# Altium schematic sheet Voltage input.SchDoc
size 431 x 279 mm; SheetNumber: 1; SheetTotal: 5
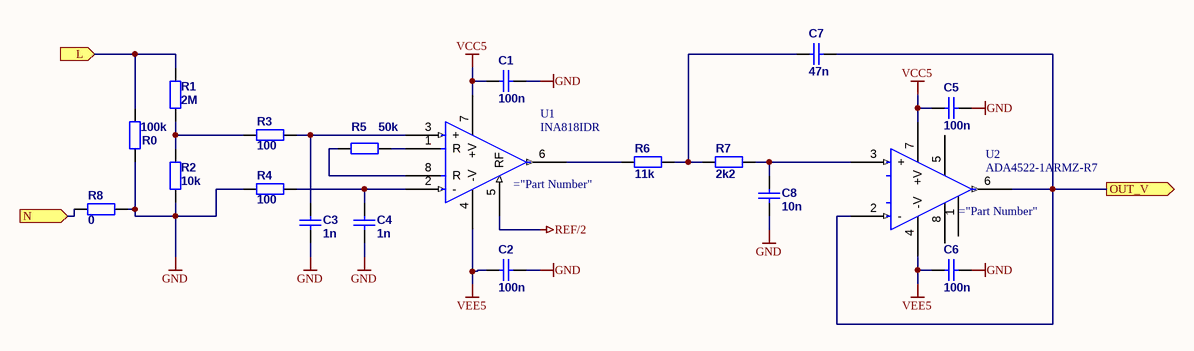
[diagram p0: Voltage input.SchDoc]

## Parts
C1  100n  [C0805]
C2  100n  [C0805]
C3  1n  [C1206]
C4  1n  [C1206]
C5  100n  [C0805]
C6  100n  [C0805]
C7  47n  [C0805]
C8  10n  [C0805]
R0  100k  [R2512]
R1  2M  [R1206]
R2  10k  [R1206]
R3  100  [R1206]
R4  100  [R1206]
R5  50k  [R0805]
R6  11k  [R0805]
R7  2k2  [R0805]
R8  0  [R1206]
U1  INA818IDR  [SOIC-8_TEX]
U2  ADA4522-1ARMZ-R7  [Analog_Devices_RM-8_IPC_C]

## Ports
L (in), N (in), OUT_V (out)

## Nets
GND: C1.2 C2.1 C3.1 C4.1 C5.1 C6.2 C8.2 R0.1 R2.2 R4.1 R8.2
REF/2: U1.5(RF)
VCC5: C1.1 C5.2 U1.7(+V) U2.7(+V)
VEE5: C2.2 C6.1 U1.4(-V) U2.4(-V)
L: R0.2 R1.1 ; port L
N: R8.1 ; port N
OUT_V: C7.1 U2.2(-) U2.6(OUT) ; port OUT_V
NetC3_2: C3.2 R3.2 U1.3(+)
NetC4_2: C4.2 R4.2 U1.2(-)
NetC7_2: C7.2 R6.2 R7.1
NetC8_1: C8.1 R7.2 U2.3(+)
NetR1_2: R1.2 R2.1 R3.1
NetR5_1: R5.1 U1.8(R)
NetR5_2: R5.2 U1.1(R)
NetR6_1: R6.1 U1.6(OUT)

Not connected (* = marked no-connect by the designer): U2 1 5 8

## Notes on the sheet
- DWG. NO.
- REV.
- SHT.
- THIS DOCUMENT AND THE DATA DISCLOSED HEREIN OR HEREWITH IS THE PROPERTY OF ALTIUM LIMITED AND MAY BE FREELY DISTRIBUTED IN WHOLE. NO RIGHTS ARE RESERVED OR EXPRESS OR IMPLIED WARANTEE GIVEN.
- REVISION
- DESCRIPTION
- DATE
- APPROVED
- ENG:
- APPROVALS
- PROJECT
- DSN:
- CHK:
- REFERENCE DOCUMENTS
- PROJECT REVISION:
- TITLE
- DOCUMENT REVISION:
- DESIGN ITEM:
- BOM:
- FAB DWG:
- PCB DWG:
- ASSY DWG:
- SCALE:
- SIZE
- B
- CAGE CODE
- FILE NAME
- DWG NO.
- SHEET
- OF
- REV

## Library data of the parts
C1-C8 = Cap: Capacitor; ComponentLink1Description: datasheet; ComponentLink2Description: supplier
  C1 C2 C5 C6: Value: 100n
  C3 C4: Value: 1n
  C7: Value: 47n
  C8: Value: 10n
R0-R8 = Res: Resistor; Published: 19-Feb-2006; ComponentLink1Description: datasheet; ComponentLink2Description: supplier
  R0: Value: 100k
  R1: Value: 2M
  R2: Value: 10k
  R3 R4: Value: 100
  R5: Value: 50k
  R6: Value: 11k
  R7: Value: 2k2
  R8: Value: 0
U1 = INA818IDR: No Description Available; Mfr_Name: Texas Instruments; Copyright: Copyright (C) 2021 Ultra Librarian. All rights reserved.; Manufacturer_Part_Number: INA818IDR; RefDes: RefDes; Type: DEV